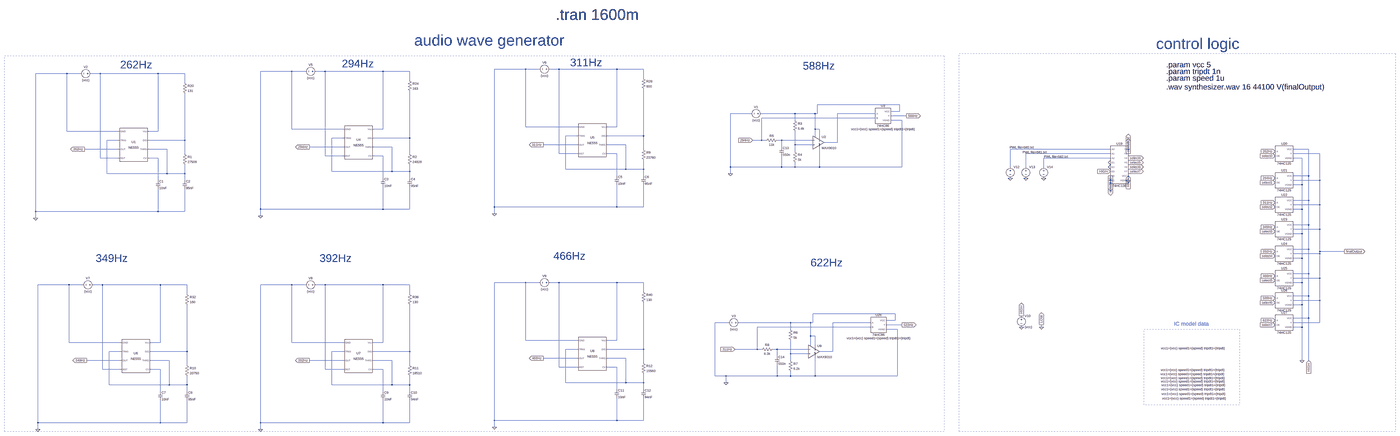
[diagram p0: schematic final.asc, whole sheet]
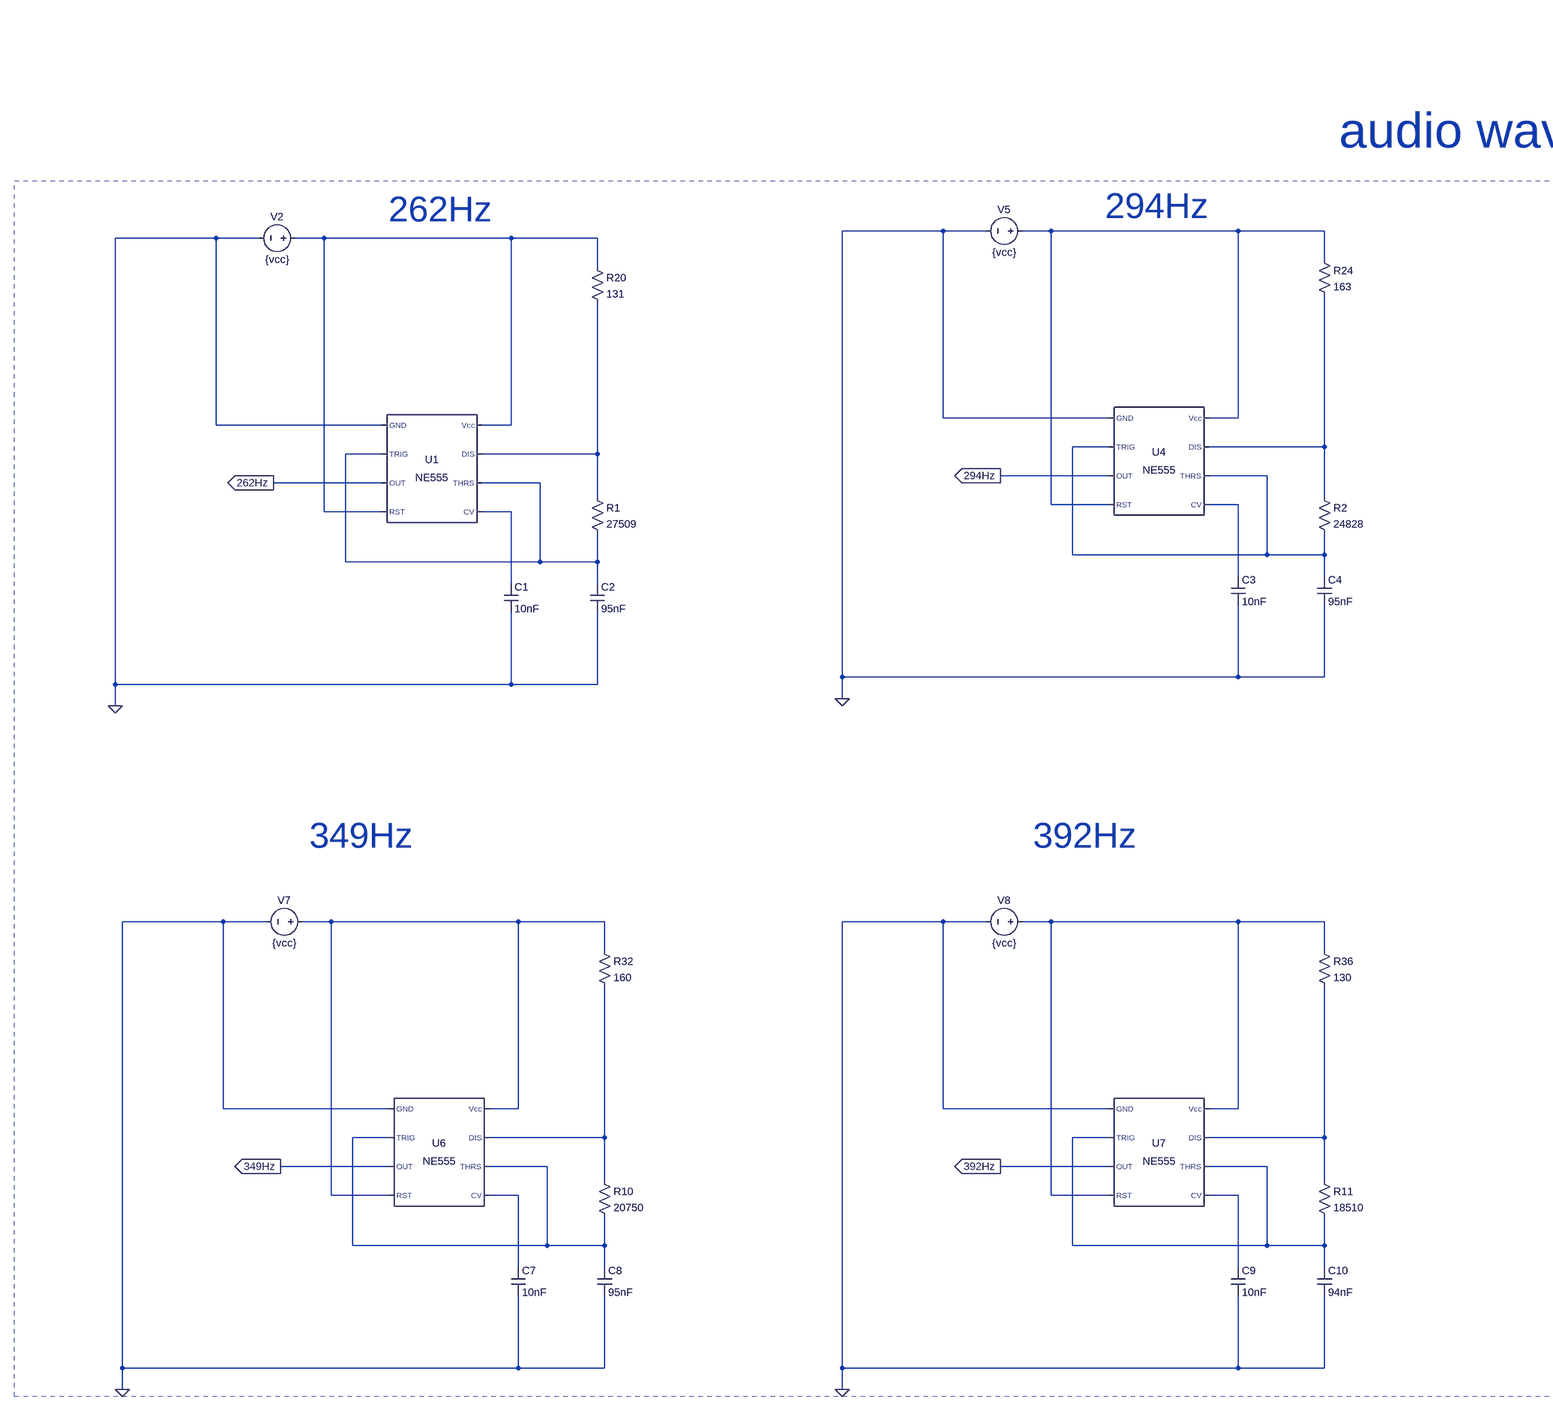
[diagram p1: schematic final.asc, part, row 1 of 1, column 1 of 3]
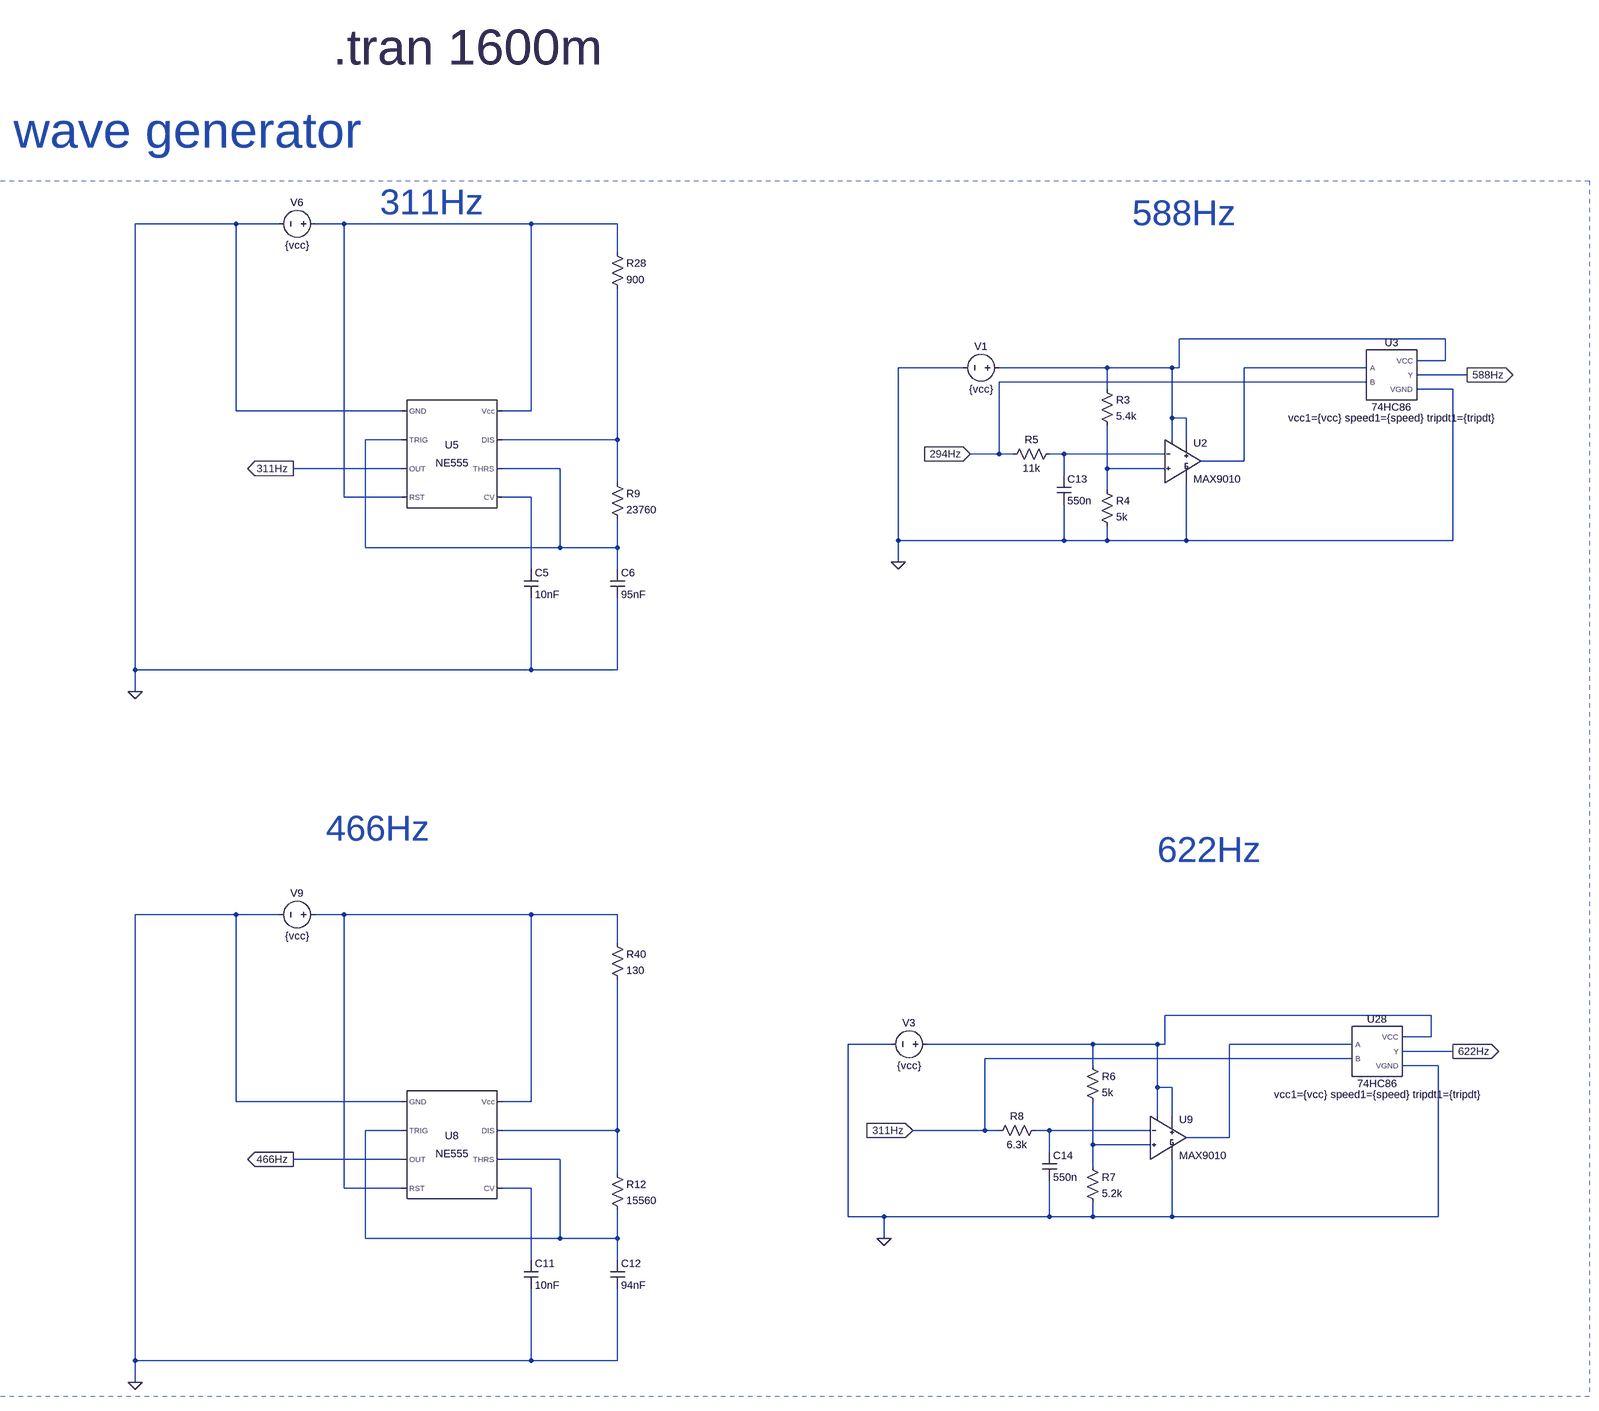
[diagram p2: schematic final.asc, part, row 1 of 1, column 2 of 3]
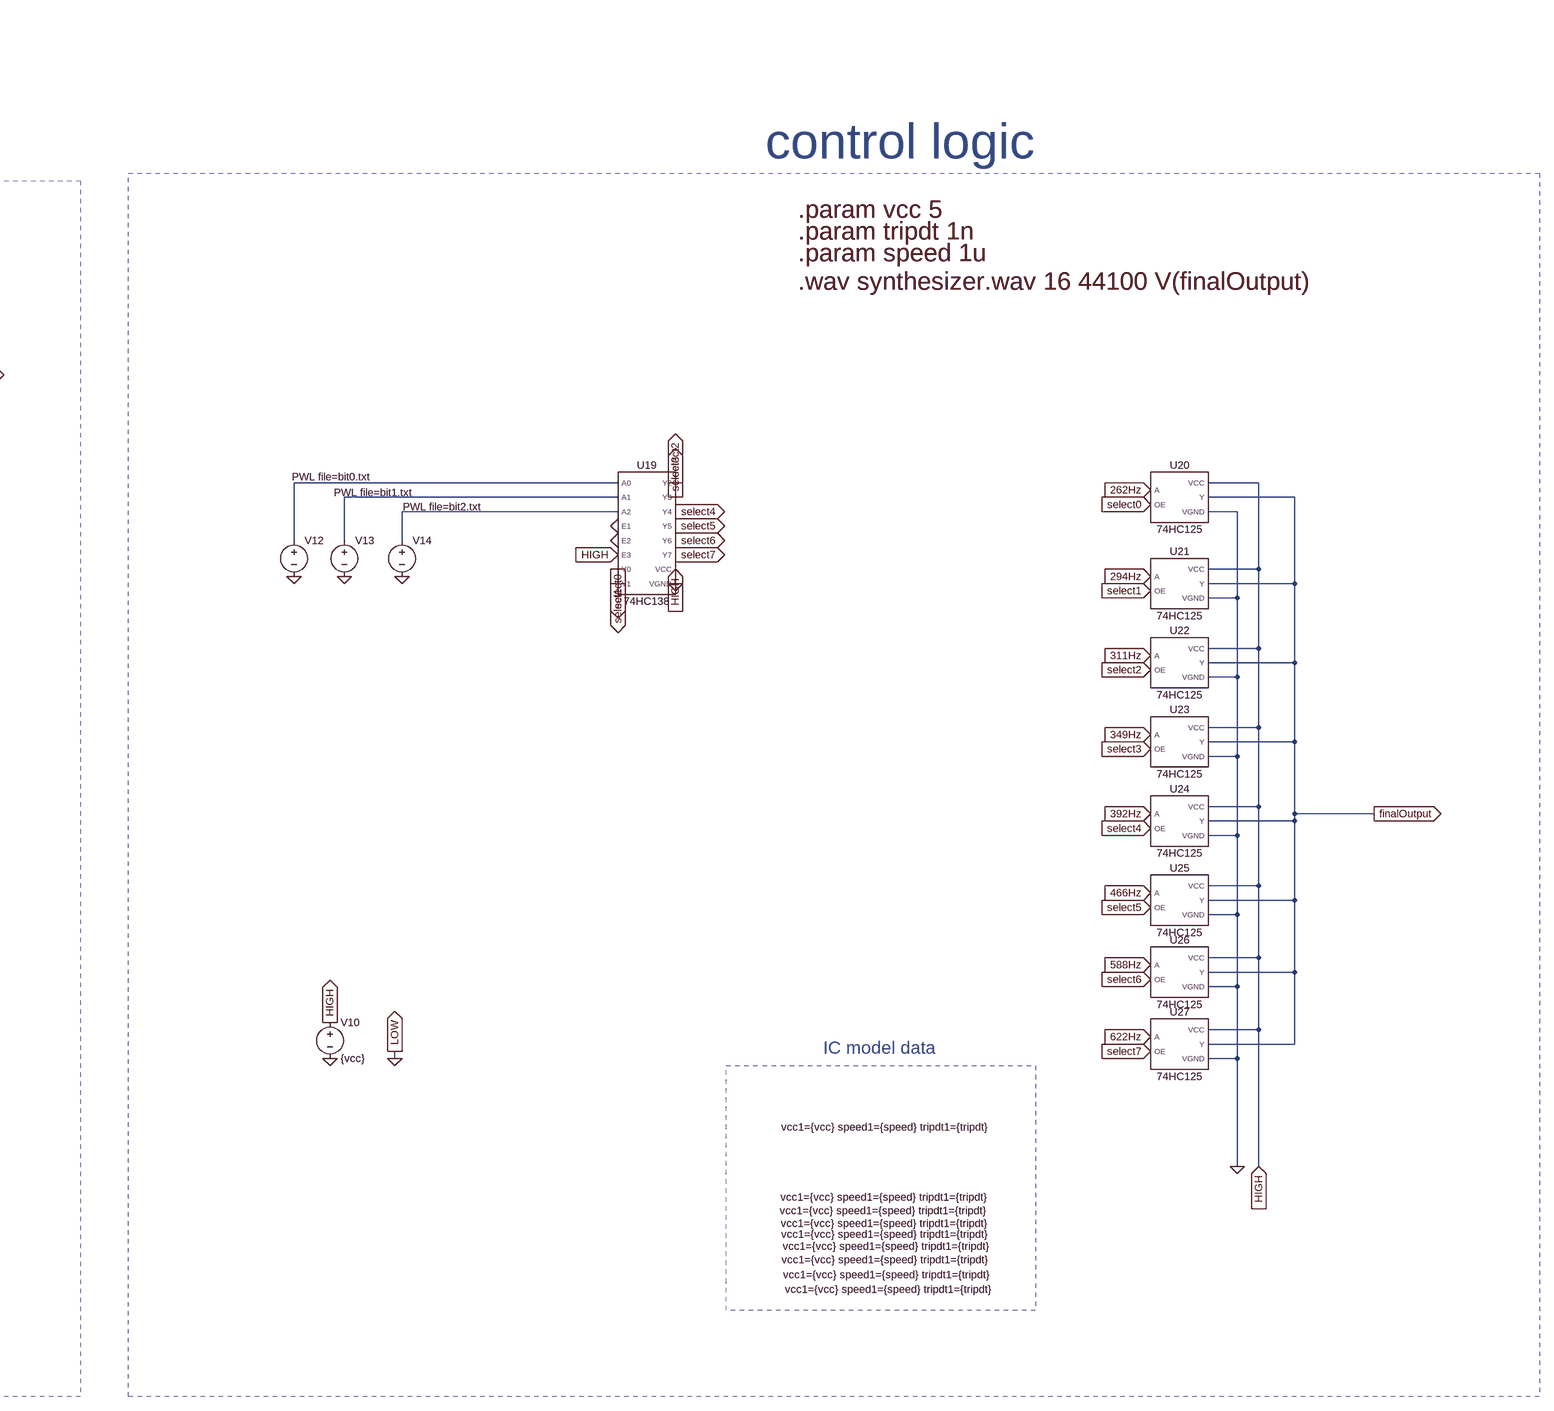
[diagram p3: schematic final.asc, part, row 1 of 1, column 3 of 3]
final.asc, the LTspice schematic file:
Version 4
SHEET 1 6260 6932
WIRE -96 -2272 -320 -2272
WIRE 0 -2272 -96 -2272
WIRE 144 -2272 80 -2272
WIRE 560 -2272 144 -2272
WIRE 752 -2272 560 -2272
WIRE -1776 -2256 -2000 -2256
WIRE -1680 -2256 -1776 -2256
WIRE -1536 -2256 -1600 -2256
WIRE -1120 -2256 -1536 -2256
WIRE -928 -2256 -1120 -2256
WIRE -3392 -2240 -3616 -2240
WIRE -3296 -2240 -3392 -2240
WIRE -3152 -2240 -3216 -2240
WIRE -2736 -2240 -3152 -2240
WIRE -2544 -2240 -2736 -2240
WIRE 752 -2208 752 -2272
WIRE -928 -2192 -928 -2256
WIRE -2544 -2176 -2544 -2240
WIRE 2592 -2016 2000 -2016
WIRE 2592 -1968 2592 -2016
WIRE 2592 -1968 2528 -1968
WIRE 1520 -1952 1376 -1952
WIRE 1840 -1952 1600 -1952
WIRE 1984 -1952 1840 -1952
WIRE 2000 -1952 2000 -2016
WIRE 2000 -1952 1984 -1952
WIRE 2416 -1952 2144 -1952
WIRE 2640 -1936 2528 -1936
WIRE 2416 -1920 1600 -1920
WIRE 1840 -1904 1840 -1952
WIRE 2608 -1904 2528 -1904
WIRE -96 -1856 -96 -2272
WIRE 272 -1856 -96 -1856
WIRE 560 -1856 560 -2272
WIRE 560 -1856 496 -1856
WIRE -1776 -1840 -1776 -2256
WIRE -1408 -1840 -1776 -1840
WIRE -1120 -1840 -1120 -2256
WIRE -1120 -1840 -1184 -1840
WIRE 1984 -1840 1984 -1952
WIRE 2016 -1840 1984 -1840
WIRE -3392 -1824 -3392 -2240
WIRE -3024 -1824 -3392 -1824
WIRE -2736 -1824 -2736 -2240
WIRE -2736 -1824 -2800 -1824
WIRE 272 -1792 192 -1792
WIRE 752 -1792 752 -2128
WIRE 752 -1792 496 -1792
WIRE 1984 -1792 1984 -1840
WIRE 2016 -1792 2016 -1840
WIRE -1408 -1776 -1488 -1776
WIRE -928 -1776 -928 -2112
WIRE -928 -1776 -1184 -1776
WIRE -3024 -1760 -3104 -1760
WIRE -2544 -1760 -2544 -2096
WIRE -2544 -1760 -2800 -1760
WIRE 1600 -1760 1600 -1920
WIRE 1600 -1760 1536 -1760
WIRE 1632 -1760 1600 -1760
WIRE 1744 -1760 1712 -1760
WIRE 1968 -1760 1744 -1760
WIRE 2144 -1744 2144 -1952
WIRE 2144 -1744 2048 -1744
WIRE 272 -1728 32 -1728
WIRE 624 -1728 496 -1728
WIRE 1840 -1728 1840 -1824
WIRE 1968 -1728 1840 -1728
WIRE -1408 -1712 -1648 -1712
WIRE -1056 -1712 -1184 -1712
WIRE 1744 -1712 1744 -1760
WIRE -3024 -1696 -3264 -1696
WIRE -2672 -1696 -2800 -1696
WIRE 752 -1696 752 -1792
WIRE 4208 -1696 3488 -1696
WIRE 5632 -1696 5520 -1696
WIRE 1840 -1680 1840 -1728
WIRE -2544 -1664 -2544 -1760
WIRE -928 -1664 -928 -1776
WIRE 144 -1664 144 -2272
WIRE 272 -1664 144 -1664
WIRE 560 -1664 496 -1664
WIRE 4208 -1664 3600 -1664
WIRE 5712 -1664 5520 -1664
WIRE -1536 -1648 -1536 -2256
WIRE -1408 -1648 -1536 -1648
WIRE -1120 -1648 -1184 -1648
WIRE -3152 -1632 -3152 -2240
WIRE -3024 -1632 -3152 -1632
WIRE -2736 -1632 -2800 -1632
WIRE 4208 -1632 3728 -1632
WIRE 5584 -1632 5520 -1632
WIRE 1376 -1568 1376 -1952
WIRE 1744 -1568 1744 -1648
WIRE 1744 -1568 1376 -1568
WIRE 1840 -1568 1840 -1600
WIRE 1840 -1568 1744 -1568
WIRE 2016 -1568 2016 -1696
WIRE 2016 -1568 1840 -1568
WIRE 2608 -1568 2608 -1904
WIRE 2608 -1568 2016 -1568
WIRE 3488 -1568 3488 -1696
WIRE 3600 -1568 3600 -1664
WIRE 3728 -1568 3728 -1632
WIRE 192 -1552 192 -1792
WIRE 624 -1552 624 -1728
WIRE 624 -1552 192 -1552
WIRE 752 -1552 752 -1616
WIRE 752 -1552 624 -1552
WIRE -1488 -1536 -1488 -1776
WIRE -1056 -1536 -1056 -1712
WIRE -1056 -1536 -1488 -1536
WIRE -928 -1536 -928 -1584
WIRE -928 -1536 -1056 -1536
WIRE -3104 -1520 -3104 -1760
WIRE -2672 -1520 -2672 -1696
WIRE -2672 -1520 -3104 -1520
WIRE -2544 -1520 -2544 -1584
WIRE -2544 -1520 -2672 -1520
WIRE 1376 -1520 1376 -1568
WIRE 560 -1504 560 -1664
WIRE 752 -1504 752 -1552
WIRE 5632 -1504 5632 -1696
WIRE 5632 -1504 5520 -1504
WIRE -1120 -1488 -1120 -1648
WIRE -928 -1488 -928 -1536
WIRE -2736 -1472 -2736 -1632
WIRE -2544 -1472 -2544 -1520
WIRE 5712 -1472 5712 -1664
WIRE 5712 -1472 5520 -1472
WIRE 5584 -1440 5584 -1632
WIRE 5584 -1440 5520 -1440
WIRE 5632 -1328 5632 -1504
WIRE 5632 -1328 5520 -1328
WIRE 5712 -1296 5712 -1472
WIRE 5712 -1296 5520 -1296
WIRE -320 -1280 -320 -2272
WIRE 560 -1280 560 -1440
WIRE 560 -1280 -320 -1280
WIRE 752 -1280 752 -1440
WIRE 752 -1280 560 -1280
WIRE -2000 -1264 -2000 -2256
WIRE -1120 -1264 -1120 -1424
WIRE -1120 -1264 -2000 -1264
WIRE -928 -1264 -928 -1424
WIRE -928 -1264 -1120 -1264
WIRE 5584 -1264 5584 -1440
WIRE 5584 -1264 5520 -1264
WIRE -3616 -1248 -3616 -2240
WIRE -2736 -1248 -2736 -1408
WIRE -2736 -1248 -3616 -1248
WIRE -2544 -1248 -2544 -1408
WIRE -2544 -1248 -2736 -1248
WIRE -320 -1232 -320 -1280
WIRE -2000 -1216 -2000 -1264
WIRE -3616 -1200 -3616 -1248
WIRE 5632 -1152 5632 -1328
WIRE 5632 -1152 5520 -1152
WIRE 5712 -1120 5712 -1296
WIRE 5712 -1120 5520 -1120
WIRE 5584 -1088 5584 -1264
WIRE 5584 -1088 5520 -1088
WIRE 5632 -976 5632 -1152
WIRE 5632 -976 5520 -976
WIRE 5712 -960 5712 -1120
WIRE 5888 -960 5712 -960
WIRE 5712 -944 5712 -960
WIRE 5712 -944 5520 -944
WIRE 5584 -912 5584 -1088
WIRE 5584 -912 5520 -912
WIRE 5632 -800 5632 -976
WIRE 5632 -800 5520 -800
WIRE 5712 -768 5712 -944
WIRE 5712 -768 5520 -768
WIRE -96 -736 -320 -736
WIRE 0 -736 -96 -736
WIRE 144 -736 80 -736
WIRE 560 -736 144 -736
WIRE 752 -736 560 -736
WIRE 5584 -736 5584 -912
WIRE 5584 -736 5520 -736
WIRE -3376 -720 -3600 -720
WIRE -3280 -720 -3376 -720
WIRE -3136 -720 -3200 -720
WIRE -2720 -720 -3136 -720
WIRE -2528 -720 -2720 -720
WIRE -1776 -720 -2000 -720
WIRE -1680 -720 -1776 -720
WIRE -1536 -720 -1600 -720
WIRE -1120 -720 -1536 -720
WIRE -928 -720 -1120 -720
WIRE 752 -672 752 -736
WIRE -2528 -656 -2528 -720
WIRE -928 -656 -928 -720
WIRE 5632 -640 5632 -800
WIRE 5632 -640 5520 -640
WIRE 5712 -608 5712 -768
WIRE 5712 -608 5520 -608
WIRE 5584 -576 5584 -736
WIRE 5584 -576 5520 -576
WIRE 2560 -512 1968 -512
WIRE 5632 -480 5632 -640
WIRE 5632 -480 5520 -480
WIRE 2560 -464 2560 -512
WIRE 2560 -464 2496 -464
WIRE 1360 -448 1264 -448
WIRE 1808 -448 1440 -448
WIRE 1952 -448 1808 -448
WIRE 1968 -448 1968 -512
WIRE 1968 -448 1952 -448
WIRE 2384 -448 2112 -448
WIRE 5712 -448 5712 -608
WIRE 5712 -448 5520 -448
WIRE 2608 -432 2496 -432
WIRE 2384 -416 1568 -416
WIRE 3712 -416 3712 -432
WIRE 5584 -416 5584 -576
WIRE 5584 -416 5520 -416
WIRE 1808 -400 1808 -448
WIRE 2576 -400 2496 -400
WIRE 1952 -352 1952 -448
WIRE 1984 -352 1952 -352
WIRE -96 -320 -96 -736
WIRE 272 -320 -96 -320
WIRE 560 -320 560 -736
WIRE 560 -320 496 -320
WIRE -3376 -304 -3376 -720
WIRE -3008 -304 -3376 -304
WIRE -2720 -304 -2720 -720
WIRE -2720 -304 -2784 -304
WIRE -1776 -304 -1776 -720
WIRE -1408 -304 -1776 -304
WIRE -1120 -304 -1120 -720
WIRE -1120 -304 -1184 -304
WIRE 1952 -288 1952 -352
WIRE 1984 -288 1984 -352
WIRE 272 -256 192 -256
WIRE 752 -256 752 -592
WIRE 752 -256 496 -256
WIRE 1568 -256 1568 -416
WIRE 1568 -256 1408 -256
WIRE 1600 -256 1568 -256
WIRE 1712 -256 1680 -256
WIRE 1936 -256 1712 -256
WIRE -3008 -240 -3088 -240
WIRE -2528 -240 -2528 -576
WIRE -2528 -240 -2784 -240
WIRE -1408 -240 -1488 -240
WIRE -928 -240 -928 -576
WIRE -928 -240 -1184 -240
WIRE 2112 -240 2112 -448
WIRE 2112 -240 2016 -240
WIRE 1808 -224 1808 -320
WIRE 1936 -224 1808 -224
WIRE 1712 -208 1712 -256
WIRE 272 -192 32 -192
WIRE 624 -192 496 -192
WIRE -3008 -176 -3248 -176
WIRE -2656 -176 -2784 -176
WIRE -1408 -176 -1648 -176
WIRE -1056 -176 -1184 -176
WIRE 1808 -176 1808 -224
WIRE 5584 -176 5584 -416
WIRE 5632 -176 5632 -480
WIRE 752 -160 752 -256
WIRE -2528 -144 -2528 -240
WIRE -928 -144 -928 -240
WIRE 144 -128 144 -736
WIRE 272 -128 144 -128
WIRE 560 -128 496 -128
WIRE -3136 -112 -3136 -720
WIRE -3008 -112 -3136 -112
WIRE -2720 -112 -2784 -112
WIRE -1536 -112 -1536 -720
WIRE -1408 -112 -1536 -112
WIRE -1120 -112 -1184 -112
WIRE 1264 -64 1264 -448
WIRE 1344 -64 1264 -64
WIRE 1712 -64 1712 -144
WIRE 1712 -64 1344 -64
WIRE 1808 -64 1808 -96
WIRE 1808 -64 1712 -64
WIRE 1984 -64 1984 -192
WIRE 1984 -64 1808 -64
WIRE 2576 -64 2576 -400
WIRE 2576 -64 1984 -64
WIRE 192 -16 192 -256
WIRE 624 -16 624 -192
WIRE 624 -16 192 -16
WIRE 752 -16 752 -80
WIRE 752 -16 624 -16
WIRE 1344 -16 1344 -64
WIRE -3088 0 -3088 -240
WIRE -2656 0 -2656 -176
WIRE -2656 0 -3088 0
WIRE -2528 0 -2528 -64
WIRE -2528 0 -2656 0
WIRE -1488 0 -1488 -240
WIRE -1056 0 -1056 -176
WIRE -1056 0 -1488 0
WIRE -928 0 -928 -64
WIRE -928 0 -1056 0
WIRE 560 32 560 -128
WIRE 752 32 752 -16
WIRE -2720 48 -2720 -112
WIRE -2528 48 -2528 0
WIRE -1120 48 -1120 -112
WIRE -928 48 -928 0
WIRE -320 256 -320 -736
WIRE 560 256 560 96
WIRE 560 256 -320 256
WIRE 752 256 752 96
WIRE 752 256 560 256
WIRE -3600 272 -3600 -720
WIRE -2720 272 -2720 112
WIRE -2720 272 -3600 272
WIRE -2528 272 -2528 112
WIRE -2528 272 -2720 272
WIRE -2000 272 -2000 -720
WIRE -1120 272 -1120 112
WIRE -1120 272 -2000 272
WIRE -928 272 -928 112
WIRE -928 272 -1120 272
WIRE -320 304 -320 256
WIRE -3600 320 -3600 272
WIRE -2000 320 -2000 272
FLAG -3616 -1200 0
FLAG -3264 -1696 262Hz
IOPIN -3264 -1696 Out
FLAG -2000 -1216 0
FLAG -1648 -1712 294Hz
IOPIN -1648 -1712 Out
FLAG -320 -1232 0
FLAG 32 -1728 311Hz
IOPIN 32 -1728 Out
FLAG -3600 320 0
FLAG -3248 -176 349Hz
IOPIN -3248 -176 Out
FLAG -1648 -176 392Hz
IOPIN -1648 -176 Out
FLAG 32 -192 466Hz
IOPIN 32 -192 Out
FLAG 1376 -1520 0
FLAG 2640 -1936 588Hz
IOPIN 2640 -1936 Out
FLAG 1344 -16 0
FLAG 2608 -432 622Hz
IOPIN 2608 -432 Out
FLAG -2000 320 0
FLAG -320 304 0
FLAG 1408 -256 311Hz
IOPIN 1408 -256 In
FLAG 1536 -1760 294Hz
IOPIN 1536 -1760 In
FLAG 3568 -416 0
FLAG 3712 -416 0
FLAG 3712 -432 LOW
IOPIN 3712 -432 Out
FLAG 3568 -496 HIGH
IOPIN 3568 -496 Out
FLAG 4208 -1600 0
FLAG 4208 -1568 0
FLAG 4208 -1536 HIGH
IOPIN 4208 -1536 In
FLAG 4208 -1504 select0
IOPIN 4208 -1504 Out
FLAG 4208 -1472 select1
IOPIN 4208 -1472 Out
FLAG 4336 -1696 select2
IOPIN 4336 -1696 Out
FLAG 4336 -1664 select3
IOPIN 4336 -1664 Out
FLAG 4336 -1632 select4
IOPIN 4336 -1632 Out
FLAG 4336 -1600 select5
IOPIN 4336 -1600 Out
FLAG 4336 -1568 select6
IOPIN 4336 -1568 Out
FLAG 4336 -1536 select7
IOPIN 4336 -1536 Out
FLAG 4336 -1504 HIGH
IOPIN 4336 -1504 In
FLAG 4336 -1472 0
FLAG 5392 -1648 select0
IOPIN 5392 -1648 In
FLAG 5392 -1456 select1
IOPIN 5392 -1456 In
FLAG 5392 -1280 select2
IOPIN 5392 -1280 In
FLAG 5392 -1104 select3
IOPIN 5392 -1104 In
FLAG 5392 -928 select4
IOPIN 5392 -928 In
FLAG 5392 -752 select5
IOPIN 5392 -752 In
FLAG 5392 -592 select6
IOPIN 5392 -592 In
FLAG 5392 -432 select7
IOPIN 5392 -432 In
FLAG 5392 -1680 262Hz
IOPIN 5392 -1680 In
FLAG 5392 -1488 294Hz
IOPIN 5392 -1488 In
FLAG 5392 -1312 311Hz
IOPIN 5392 -1312 In
FLAG 5392 -1136 349Hz
IOPIN 5392 -1136 In
FLAG 5392 -960 392Hz
IOPIN 5392 -960 In
FLAG 5392 -784 466Hz
IOPIN 5392 -784 In
FLAG 5392 -624 588Hz
IOPIN 5392 -624 In
FLAG 5392 -464 622Hz
IOPIN 5392 -464 In
FLAG 5584 -176 0
FLAG 5632 -176 HIGH
IOPIN 5632 -176 In
FLAG 5888 -960 finalOutput
IOPIN 5888 -960 Out
FLAG 3488 -1488 0
FLAG 3600 -1488 0
FLAG 3728 -1488 0
SYMBOL Misc\\NE555 -2912 -1728 R0
SYMATTR InstName U1
SYMBOL cap -2752 -1472 R0
SYMATTR InstName C1
SYMATTR Value 10nF
SYMBOL cap -2560 -1472 R0
SYMATTR InstName C2
SYMATTR Value 95nF
SYMBOL voltage -3200 -2240 R90
WINDOW 0 -32 56 VBottom 2
WINDOW 3 32 56 VTop 2
WINDOW 123 0 0 Left 0
WINDOW 39 0 0 Left 0
SYMATTR InstName V2
SYMATTR Value {vcc}
SYMBOL res -2560 -2192 R0
SYMATTR InstName R20
SYMATTR Value 131
SYMATTR SpiceLine tol=1 pwr=0.1
SYMBOL Misc\\NE555 -1296 -1744 R0
SYMATTR InstName U4
SYMBOL cap -1136 -1488 R0
SYMATTR InstName C3
SYMATTR Value 10nF
SYMBOL cap -944 -1488 R0
SYMATTR InstName C4
SYMATTR Value 95nF
SYMBOL voltage -1584 -2256 R90
WINDOW 0 -32 56 VBottom 2
WINDOW 3 32 56 VTop 2
WINDOW 123 0 0 Left 0
WINDOW 39 0 0 Left 0
SYMATTR InstName V5
SYMATTR Value {vcc}
SYMBOL res -944 -2208 R0
SYMATTR InstName R24
SYMATTR Value 163
SYMATTR SpiceLine tol=1 pwr=0.1
SYMBOL Misc\\NE555 384 -1760 R0
SYMATTR InstName U5
SYMBOL cap 544 -1504 R0
SYMATTR InstName C5
SYMATTR Value 10nF
SYMBOL cap 736 -1504 R0
SYMATTR InstName C6
SYMATTR Value 95nF
SYMBOL voltage 96 -2272 R90
WINDOW 0 -32 56 VBottom 2
WINDOW 3 32 56 VTop 2
WINDOW 123 0 0 Left 0
WINDOW 39 0 0 Left 0
SYMATTR InstName V6
SYMATTR Value {vcc}
SYMBOL res 736 -2224 R0
SYMATTR InstName R28
SYMATTR Value 900
SYMATTR SpiceLine tol=1 pwr=0.1
SYMBOL Misc\\NE555 -2896 -208 R0
SYMATTR InstName U6
SYMBOL cap -2736 48 R0
SYMATTR InstName C7
SYMATTR Value 10nF
SYMBOL cap -2544 48 R0
SYMATTR InstName C8
SYMATTR Value 95nF
SYMBOL voltage -3184 -720 R90
WINDOW 0 -32 56 VBottom 2
WINDOW 3 32 56 VTop 2
WINDOW 123 0 0 Left 0
WINDOW 39 0 0 Left 0
SYMATTR InstName V7
SYMATTR Value {vcc}
SYMBOL res -2544 -672 R0
SYMATTR InstName R32
SYMATTR Value 160
SYMATTR SpiceLine tol=1 pwr=0.1
SYMBOL Misc\\NE555 -1296 -208 R0
SYMATTR InstName U7
SYMBOL cap -1136 48 R0
SYMATTR InstName C9
SYMATTR Value 10nF
SYMBOL cap -944 48 R0
SYMATTR InstName C10
SYMATTR Value 94nF
SYMBOL voltage -1584 -720 R90
WINDOW 0 -32 56 VBottom 2
WINDOW 3 32 56 VTop 2
WINDOW 123 0 0 Left 0
WINDOW 39 0 0 Left 0
SYMATTR InstName V8
SYMATTR Value {vcc}
SYMBOL res -944 -672 R0
SYMATTR InstName R36
SYMATTR Value 130
SYMATTR SpiceLine tol=1 pwr=0.1
SYMBOL Misc\\NE555 384 -224 R0
SYMATTR InstName U8
SYMBOL cap 544 32 R0
SYMATTR InstName C11
SYMATTR Value 10nF
SYMBOL cap 736 32 R0
SYMATTR InstName C12
SYMATTR Value 94nF
SYMBOL voltage 96 -736 R90
WINDOW 0 -32 56 VBottom 2
WINDOW 3 32 56 VTop 2
WINDOW 123 0 0 Left 0
WINDOW 39 0 0 Left 0
SYMATTR InstName V9
SYMATTR Value {vcc}
SYMBOL res 736 -688 R0
SYMATTR InstName R40
SYMATTR Value 130
SYMATTR SpiceLine tol=1 pwr=0.1
SYMBOL voltage 1616 -1952 R90
WINDOW 0 -32 56 VBottom 2
WINDOW 3 32 56 VTop 2
WINDOW 123 0 0 Left 0
WINDOW 39 0 0 Left 0
SYMATTR InstName V1
SYMATTR Value {vcc}
SYMBOL res 1824 -1920 R0
SYMATTR InstName R3
SYMATTR Value 5.4k
SYMBOL res 1824 -1696 R0
SYMATTR InstName R4
SYMATTR Value 5k
SYMBOL res 1728 -1776 R90
WINDOW 0 0 56 VBottom 2
WINDOW 3 32 56 VTop 2
SYMATTR InstName R5
SYMATTR Value 11k
SYMBOL cap 1728 -1712 R0
SYMATTR InstName C13
SYMATTR Value 550n
SYMBOL voltage 1456 -448 R90
WINDOW 0 -32 56 VBottom 2
WINDOW 3 32 56 VTop 2
WINDOW 123 0 0 Left 0
WINDOW 39 0 0 Left 0
SYMATTR InstName V3
SYMATTR Value {vcc}
SYMBOL res 1792 -416 R0
SYMATTR InstName R6
SYMATTR Value 5k
SYMBOL res 1792 -192 R0
SYMATTR InstName R7
SYMATTR Value 5.2k
SYMBOL res 1696 -272 R90
WINDOW 0 0 56 VBottom 2
WINDOW 3 32 56 VTop 2
SYMATTR InstName R8
SYMATTR Value 6.3k
SYMBOL cap 1696 -208 R0
SYMATTR InstName C14
SYMATTR Value 550n
SYMBOL res -2560 -1680 R0
SYMATTR InstName R1
SYMATTR Value 27509
SYMATTR SpiceLine tol=1 pwr=0.1
SYMBOL res -944 -1680 R0
SYMATTR InstName R2
SYMATTR Value 24828
SYMATTR SpiceLine tol=1 pwr=0.1
SYMBOL res 736 -1712 R0
SYMATTR InstName R9
SYMATTR Value 23760
SYMATTR SpiceLine tol=1 pwr=0.1
SYMBOL res -2544 -160 R0
SYMATTR InstName R10
SYMATTR Value 20750
SYMATTR SpiceLine tol=1 pwr=0.1
SYMBOL res -944 -160 R0
SYMATTR InstName R11
SYMATTR Value 18510
SYMATTR SpiceLine tol=1 pwr=0.1
SYMBOL res 736 -176 R0
SYMATTR InstName R12
SYMATTR Value 15560
SYMATTR SpiceLine tol=1 pwr=0.1
SYMBOL voltage 3568 -512 R0
WINDOW 123 0 0 Left 0
WINDOW 39 0 0 Left 0
SYMATTR InstName V10
SYMATTR Value {vcc}
SYMBOL 74HC\\74HC138 4272 -1584 R0
WINDOW 39 528 1305 Top 2
SYMATTR InstName U19
SYMBOL 74HC\\74HC125 5456 -1664 R0
WINDOW 39 -658 1541 Top 2
SYMATTR InstName U20
SYMBOL 74HC\\74HC125 5456 -1472 R0
WINDOW 39 -659 1379 Top 2
SYMATTR InstName U21
SYMBOL 74HC\\74HC125 5456 -1296 R0
WINDOW 39 -657 1231 Top 2
SYMATTR InstName U22
SYMBOL 74HC\\74HC125 5456 -1120 R0
WINDOW 39 -648 1202 Top 2
SYMATTR InstName U23
SYMBOL 74HC\\74HC125 5456 -944 R0
WINDOW 39 -656 903 Top 2
SYMATTR InstName U24
SYMBOL 74HC\\74HC125 5456 -768 R0
WINDOW 39 -653 754 Top 2
SYMATTR InstName U25
SYMBOL 74HC\\74HC125 5456 -608 R0
WINDOW 39 -655 624 Top 2
SYMATTR InstName U26
SYMBOL 74HC\\74HC125 5456 -448 R0
WINDOW 39 -652 497 Top 2
SYMATTR InstName U27
SYMBOL 74HC\\74HC86 2464 -1936 R0
SYMATTR InstName U3
SYMBOL 74HC\\74HC86 2432 -432 R0
SYMATTR InstName U28
SYMBOL Comparators\\MAX9010 2000 -1744 R0
SYMATTR InstName U2
SYMBOL Comparators\\MAX9010 1968 -240 R0
SYMATTR InstName U9
SYMBOL voltage 3488 -1584 R0
WINDOW 3 -5 -125 Left 2
WINDOW 123 0 0 Left 0
WINDOW 39 0 0 Left 0
SYMATTR Value PWL file=bit0.txt
SYMATTR InstName V12
SYMBOL voltage 3600 -1584 R0
WINDOW 3 -23 -90 Left 2
WINDOW 123 0 0 Left 0
WINDOW 39 0 0 Left 0
SYMATTR Value PWL file=bit1.txt
SYMATTR InstName V13
SYMBOL voltage 3728 -1584 R0
WINDOW 3 2 -59 Left 2
WINDOW 123 0 0 Left 0
WINDOW 39 0 0 Left 0
SYMATTR Value PWL file=bit2.txt
SYMATTR InstName V14
TEXT 120 -3120 Left 7 !.tran 1600m
TEXT 4608 -2304 Left 5 !.param vcc 5
TEXT 4608 -2256 Left 5 !.param tripdt 1n
TEXT 4608 -2208 Left 5 !.param speed 1u
TEXT -896 -2480 Left 7 ;audio wave generator
TEXT 4536 -2456 Left 7 ;control logic
TEXT 4664 -440 Left 4 ;IC model data
TEXT -3008 -2304 Left 6 ;262Hz
TEXT -1416 -2312 Left 6 ;294Hz
TEXT 224 -2320 Left 6 ;311Hz
TEXT 1896 -2296 Left 6 ;588Hz
TEXT 1952 -880 Left 6 ;622Hz
TEXT 104 -928 Left 6 ;466Hz
TEXT -1576 -912 Left 6 ;392Hz
TEXT -3184 -912 Left 6 ;349Hz
TEXT 4608 -2144 Left 5 !.wav synthesizer.wav 16 44100 V(finalOutput)
RECTANGLE Normal 2912 336 -3840 -2368 2
RECTANGLE Normal 6256 336 3120 -2384 2
RECTANGLE Normal 5136 144 4448 -400 2

The netlist it stands for:
* final.asc
XU1 0 N010 262Hz N003 N018 N010 N011 N003 NE555  ; pins GND TRIG OUT RST CV THRS DIS Vcc
C1 N018 0 10nF
C2 N010 0 95nF
V2 N003 0 {vcc}
R20 N003 N011 131 tol=1 pwr=0.1
XU4 0 N008 294Hz N002 N017 N008 N009 N002 NE555  ; pins GND TRIG OUT RST CV THRS DIS Vcc
C3 N017 0 10nF
C4 N008 0 95nF
V5 N002 0 {vcc}
R24 N002 N009 163 tol=1 pwr=0.1
XU5 0 N006 311Hz N001 N015 N006 N007 N001 NE555  ; pins GND TRIG OUT RST CV THRS DIS Vcc
C5 N015 0 10nF
C6 N006 0 95nF
V6 N001 0 {vcc}
R28 N001 N007 900 tol=1 pwr=0.1
XU6 0 N028 349Hz N021 N034 N028 N029 N021 NE555  ; pins GND TRIG OUT RST CV THRS DIS Vcc
C7 N034 0 10nF
C8 N028 0 95nF
V7 N021 0 {vcc}
R32 N021 N029 160 tol=1 pwr=0.1
XU7 0 N030 392Hz N022 N035 N030 N031 N022 NE555  ; pins GND TRIG OUT RST CV THRS DIS Vcc
C9 N035 0 10nF
C10 N030 0 94nF
V8 N022 0 {vcc}
R36 N022 N031 130 tol=1 pwr=0.1
XU8 0 N025 466Hz N020 N033 N025 N026 N020 NE555  ; pins GND TRIG OUT RST CV THRS DIS Vcc
C11 N033 0 10nF
C12 N025 0 94nF
V9 N020 0 {vcc}
R40 N020 N026 130 tol=1 pwr=0.1
V1 N004 0 {vcc}
R3 N004 N013 5.4k
R4 N013 0 5k
R5 N012 294Hz 11k
C13 N012 0 550n
V3 N023 0 {vcc}
R6 N023 N032 5k
R7 N032 0 5.2k
R8 N027 311Hz 6.3k
C14 N027 0 550n
R1 N011 N010 27509 tol=1 pwr=0.1
R2 N009 N008 24828 tol=1 pwr=0.1
R9 N007 N006 23760 tol=1 pwr=0.1
R10 N029 N028 20750 tol=1 pwr=0.1
R11 N031 N030 18510 tol=1 pwr=0.1
R12 N026 N025 15560 tol=1 pwr=0.1
V10 HIGH 0 {vcc}
XU19 N014 N016 N019 0 0 HIGH select0 select1 select2 select3 select4 select5 select6 select7 HIGH 0 74HC138 vcc1={vcc} speed1={speed} tripdt1={tripdt}  ; pins A0 A1 A2 E1 E2 E3 Y0 Y1 Y2 Y3 Y4 Y5 Y6 Y7 VCC VGND
XU20 262Hz select0 finalOutput HIGH 0 74HC125 vcc1={vcc} speed1={speed} tripdt1={tripdt}  ; pins A OE Y VCC VGND
XU21 294Hz select1 finalOutput HIGH 0 74HC125 vcc1={vcc} speed1={speed} tripdt1={tripdt}  ; pins A OE Y VCC VGND
XU22 311Hz select2 finalOutput HIGH 0 74HC125 vcc1={vcc} speed1={speed} tripdt1={tripdt}  ; pins A OE Y VCC VGND
XU23 349Hz select3 finalOutput HIGH 0 74HC125 vcc1={vcc} speed1={speed} tripdt1={tripdt}  ; pins A OE Y VCC VGND
XU24 392Hz select4 finalOutput HIGH 0 74HC125 vcc1={vcc} speed1={speed} tripdt1={tripdt}  ; pins A OE Y VCC VGND
XU25 466Hz select5 finalOutput HIGH 0 74HC125 vcc1={vcc} speed1={speed} tripdt1={tripdt}  ; pins A OE Y VCC VGND
XU26 588Hz select6 finalOutput HIGH 0 74HC125 vcc1={vcc} speed1={speed} tripdt1={tripdt}  ; pins A OE Y VCC VGND
XU27 622Hz select7 finalOutput HIGH 0 74HC125 vcc1={vcc} speed1={speed} tripdt1={tripdt}  ; pins A OE Y VCC VGND
XU3 N005 294Hz 588Hz N004 0 74HC86 vcc1={vcc} speed1={speed} tripdt1={tripdt}  ; pins A B Y VCC VGND
XU28 N024 311Hz 622Hz N023 0 74HC86 vcc1={vcc} speed1={speed} tripdt1={tripdt}  ; pins A B Y VCC VGND
XU2 N005 0 N013 N012 N004 N004 MAX9010  ; pins OUT GND In+ In- Vcc Vcc
XU9 N024 0 N032 N027 N023 N023 MAX9010  ; pins OUT GND In+ In- Vcc Vcc
V12 N014 0 PWL file=bit0.txt
V13 N016 0 PWL file=bit1.txt
V14 N019 0 PWL file=bit2.txt
.tran 1600m
.param vcc 5
.param tripdt 1n
.param speed 1u
* audio wave generator
* control logic
* IC model data
* 262Hz
* 294Hz
* 311Hz
* 588Hz
* 622Hz
* 466Hz
* 392Hz
* 349Hz
.wav synthesizer.wav 16 44100 V(finalOutput)
.lib NE555.sub
.lib 74HC.lib
.lib MAX9010.lib
.backanno
.end